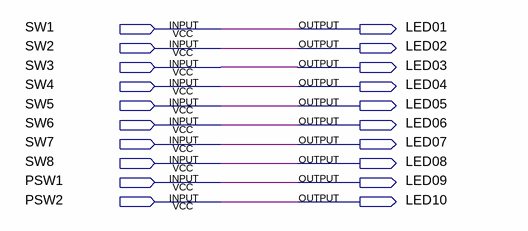
[diagram p0: schematic sheet]
// Quartus schematic q1.bdf as structural Verilog: 0 symbols, 20 pins
module q1 (
  input  SW1,
  input  SW2,
  input  SW3,
  input  SW4,
  input  SW5,
  input  SW6,
  input  SW7,
  input  SW8,
  input  PSW1,
  input  PSW2,
  output LED01,
  output LED02,
  output LED03,
  output LED04,
  output LED05,
  output LED06,
  output LED07,
  output LED08,
  output LED09,
  output LED10
);


  assign LED01 = SW1;
  assign LED02 = SW2;
  assign LED03 = SW3;
  assign LED04 = SW4;
  assign LED05 = SW5;
  assign LED06 = SW6;
  assign LED07 = SW7;
  assign LED08 = SW8;
  assign LED09 = PSW1;
  assign LED10 = PSW2;
endmodule
